# Altium schematic sheet OpenMPPT2-Safety.SchDoc: =Project + Document
size A4; SheetNumber: 6; SheetTotal: SheetTotaal; Document: Safety
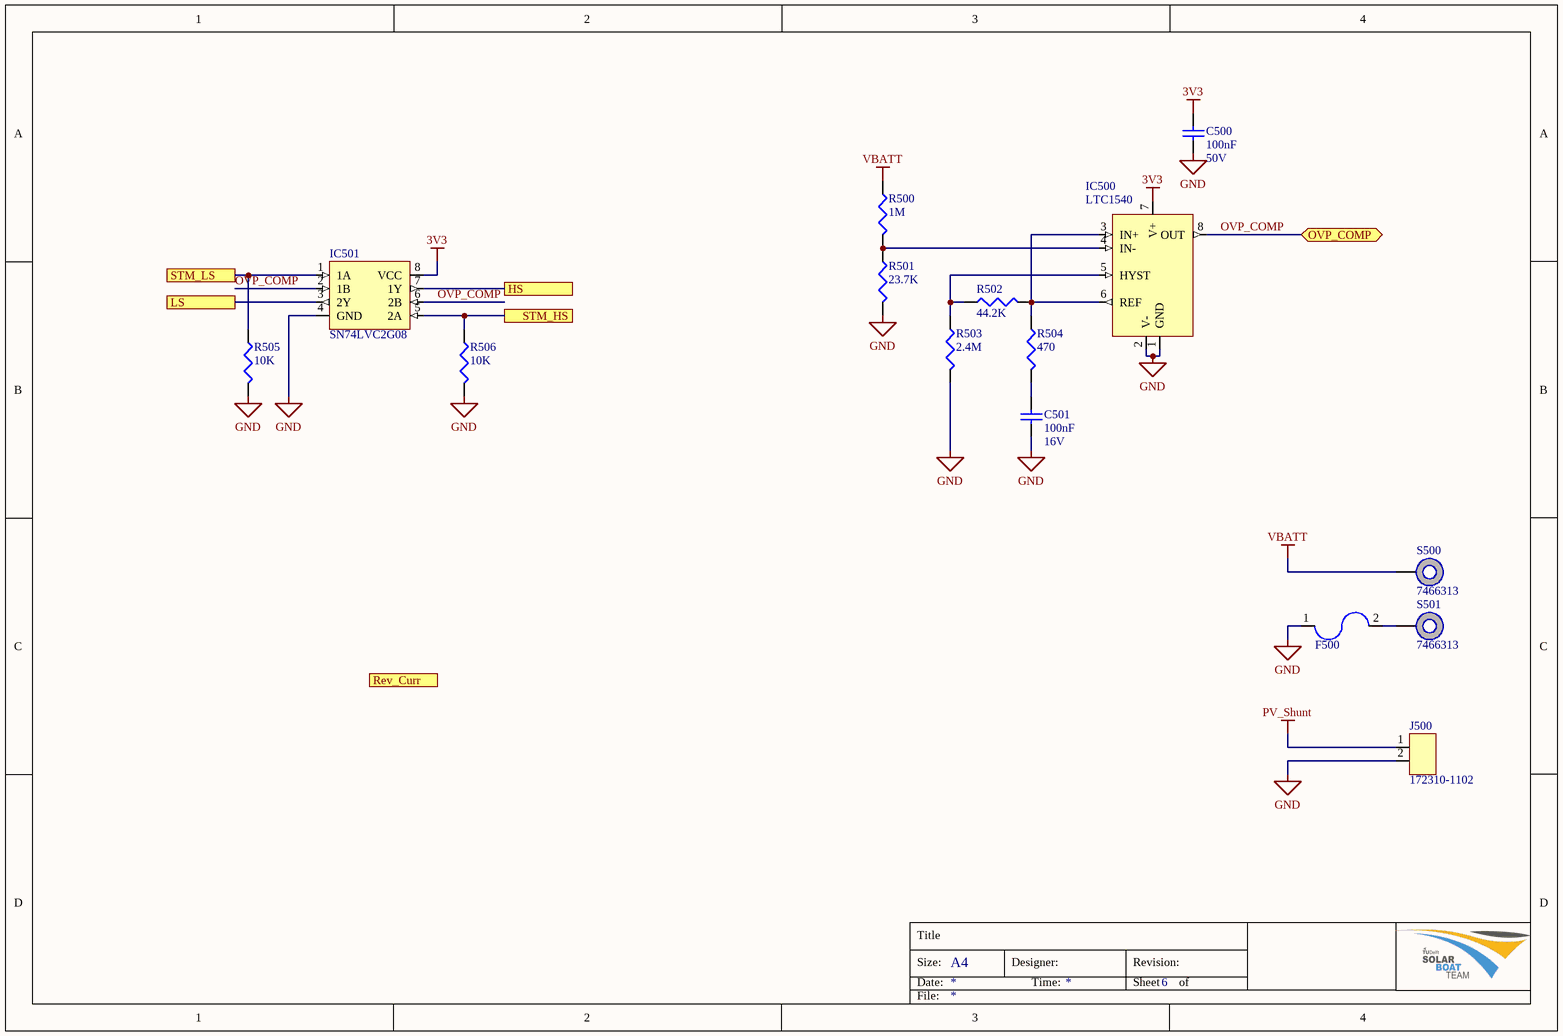
[diagram p0: OpenMPPT2-Safety.SchDoc]

## Parts
C500  100nF  Voltage Rating: 50V  [C0603]
C501  100nF  Voltage Rating: 16V  [C0603]
F500  0154010.DR  [0154010.DR]  (value not drawn)
IC500  LTC1540  [SO-8]
IC501  SN74LVC2G08  [SSOP-8]
J500  172310-1102  [Ultra Fit 2P - Right Angle]
R500  1M  [0603]
R501  23.7K  [0603]
R502  44.2K  [0603]
R503  2.4M  [0603]
R504  470  [0603]
R505  10K  [0603]
R506  10K  [0603]
S500  7466313  [7466313]
S501  7466313  [7466313]

## Ports
HS, LS, OVP_COMP, Rev_Curr, STM_HS, STM_LS

## Nets
3V3: C500.2 IC500.7(V+) IC501.8(VCC)
GND: C500.1 C501.2 F500.1 IC500.1(GND) IC500.2(V-) IC501.4(GND) J500.2 R501.2 R503.2 R505.2 R506.2
PV_Shunt: J500.1
VBATT: R500.1 S500.1
HS: IC501.7(1Y) ; port HS
LS: IC501.3(2Y) ; port LS
OVP_COMP: IC500.8(OUT) IC501.2(1B) IC501.6(2B) ; port OVP_COMP
STM_HS: IC501.5(2A) R506.1 ; port STM_HS
STM_LS: IC501.1(1A) R505.1 ; port STM_LS
NetC501_1: C501.1 R504.2
NetF500_2: F500.2 S501.1
NetIC500_3: IC500.3(IN+) IC500.6(REF) R502.2 R504.1
NetIC500_4: IC500.4(IN-) R500.2 R501.1
NetIC500_5: IC500.5(HYST) R502.1 R503.1

## Notes on the sheet
- Title
- Size:
- Date:
- A4
- Designer:
- Time:
- Revision:
- Sheet
- of
- File:

## Library data of the parts
C500 = 100nF/0603/CER/50V: Capacitor, 100nF, 50V, X7R; Capacitance Tolerance: ± 10%; Capacitor Case Style: 0603; Brand Number: MCCA000255; Brand: MULTICOMP; Dielectric Characteristic: X7R; Capacitance: 100nF; Temperature Range: -55°C to +125°C; Price: 0,008; Order Code Supplier: 1759122RL; Supplier: Farnell
C501 = 100nF/0603/CER/16V: Capacitor, 100nF, 16V, X7R; Capacitance Tolerance: ± 10%; Capacitor Case Style: 0603; Brand Number: MC0603B104K160CT; Brand: MULTICOMP; Dielectric Characteristic: X7R; Capacitance: 100nF; Temperature Range: -55°C to +125°C; Price: 0,01; Order Code Supplier: 1759016; Supplier: Farnell
F500 = 0154010.DR: Miniature SMD Fuse and Holder Assembly, 10A; Supplier: Farnell; Price: 1,53; Order Code Supplier: 2688684; Brand Number: 0154010.DR
IC500 = LTC1540: ANALOGUE COMPARATOR, RAIL TO RAIL; Brand: LINEAR TECHNOLOGY; Case Style: SOIC8; Brand Number: LTC1540; Order Code Supplier: 1651908; Price: 3,05; Supplier: Farnell; Temperature Range: 0°C to +70°C
IC501 = SN74LVC2G08: Dual 2-Input Positive-AND Gate; Brand: Texas Instruments; Case Style: VSSOP-8/SSOP-8; Brand Number: SN74LVC2G08; Supplier: Farnell; Order Code Supplier: 2142394/1470871; Price: 0,765
J500 = 172310-1102: Molex ultra-fit 2 pins connector, single row, right angle; Case Style: 172310; Pitch: 3.5mm; Brand: MOLEX; Brand Number: 172310-1102; Order Code Supplier: 2494361; Price: 0,664; Supplier: Farnell
R500 = 1M/0603/0063W/50V: Resistor, 1M, 1%, 0.063W, 50V, 100PPM, 0603; Brand: MULTICOMP; Brand Number: MC 0.063W 0603 1% 1M; Case Style: 0603; Order Code Supplier: 9330410; Power Rating: 0.063W; Price: 0,038; Resistance: 1M; Supplier: Farnell; Temperature Coefficient: ± 100PPM; Temperature Range: -55°C to +125°C; Voltage Rating: 50V
R501 = 23.7K/0603/0100W/75V: Resistor, 23.7K, 1%, 0.1W, 75V, 100PPM, 0603; Brand: Vishay; Brand Number: CRCW060323K7FKEA.; Case Style: 0603; Order Code Supplier: 2138445; Power Rating: 0.1W; Price: 0,0126; Resistance: 23.7K; Supplier: Farnell; Temperature Coefficient: ± 100PPM; Temperature Range: -55°C to +155°C; Voltage Rating: 75V
R502 = 44.2K/0603/0100W/75V: Resistor, 44.2K, 1%, 0.1W, 75V, 100PPM, 0603; Brand: Vishay; Brand Number: CRCW060344K2FKEA.; Case Style: 0603; Order Code Supplier: 2122574; Power Rating: 0.1W; Price: 0,0047; Resistance: 44.2K; Supplier: Farnell; Temperature Coefficient: ± 100PPM; Temperature Range: -55°C to +155°C; Voltage Rating: 75V
R503 = 2.4M/0603/0100W/75V: Resistor, 2.4M, 1%, 0.1W, 75V, 100PPM, 0603; Brand: Vishay; Brand Number: CRCW06032M40FKEA.; Case Style: 0603; Order Code Supplier: 2138651; Power Rating: 0.1W; Price: 0,0158; Resistance: 2.4M; Supplier: Farnell; Temperature Coefficient: ± 100PPM; Temperature Range: -55°C to +155°C; Voltage Rating: 75V
R504 = 470/0603/0063W/50V: Resistor, 470, 1%, 0.063W, 50V, 100PPM, 0603; Brand: MULTICOMP; Brand Number: MC0063W06031470R; Case Style: 0603; Order Code Supplier: 2130829; Power Rating: 0.063W; Price: 0,038; Resistance: 470; Supplier: Farnell; Temperature Coefficient: ± 100PPM; Temperature Range: -55°C to +125°C; Voltage Rating: 50V
R505 R506 = 10K/0603/0063W/50V: Resistor, 10K, 1%, 0.063W, 50V, 100PPM, 0603; Brand: MULTICOMP; Brand Number: MC0063W0603110K; Case Style: 0603; Order Code Supplier: 1469748; Power Rating: 0.063W; Price: 0,038; Resistance: 10K; Supplier: Farnell; Temperature Coefficient: ± 100PPM; Temperature Range: -55°C to +125°C; Voltage Rating: 50V
S500 S501 = 7466313: WP-SMRA SMT Right Angle M3 Thread; PublishedDate: Aug 2016; Publisher: Wurth Elektronik; ComponentLink1Description: Manufacturer; ComponentLink1URL: http://www.we-online.de; ComponentLink2Description: Datasheet; PartNumber: 7466313